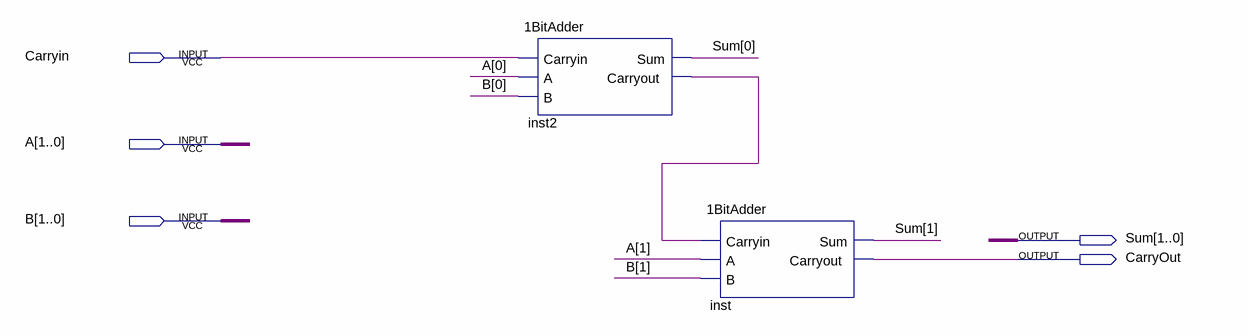
[diagram p0: schematic sheet]
// Quartus schematic 2BitAdder.bdf as structural Verilog: 2 symbols, 5 pins
module \2BitAdder  (
  input  Carryin,
  input  [1:0] A,
  input  [1:0] B,
  output [1:0] Sum,
  output CarryOut
);

  wire inst2_carryout;

  \1BitAdder  inst2 (.Carryin(Carryin), .A(A[0]), .B(B[0]), .Sum(Sum[0]), .Carryout(inst2_carryout));
  \1BitAdder  inst (.Carryin(inst2_carryout), .A(A[1]), .B(B[1]), .Sum(Sum[1]), .Carryout(CarryOut));
endmodule
